# EAGLE design Cheer_vibes (EAGLE 9.4.2)
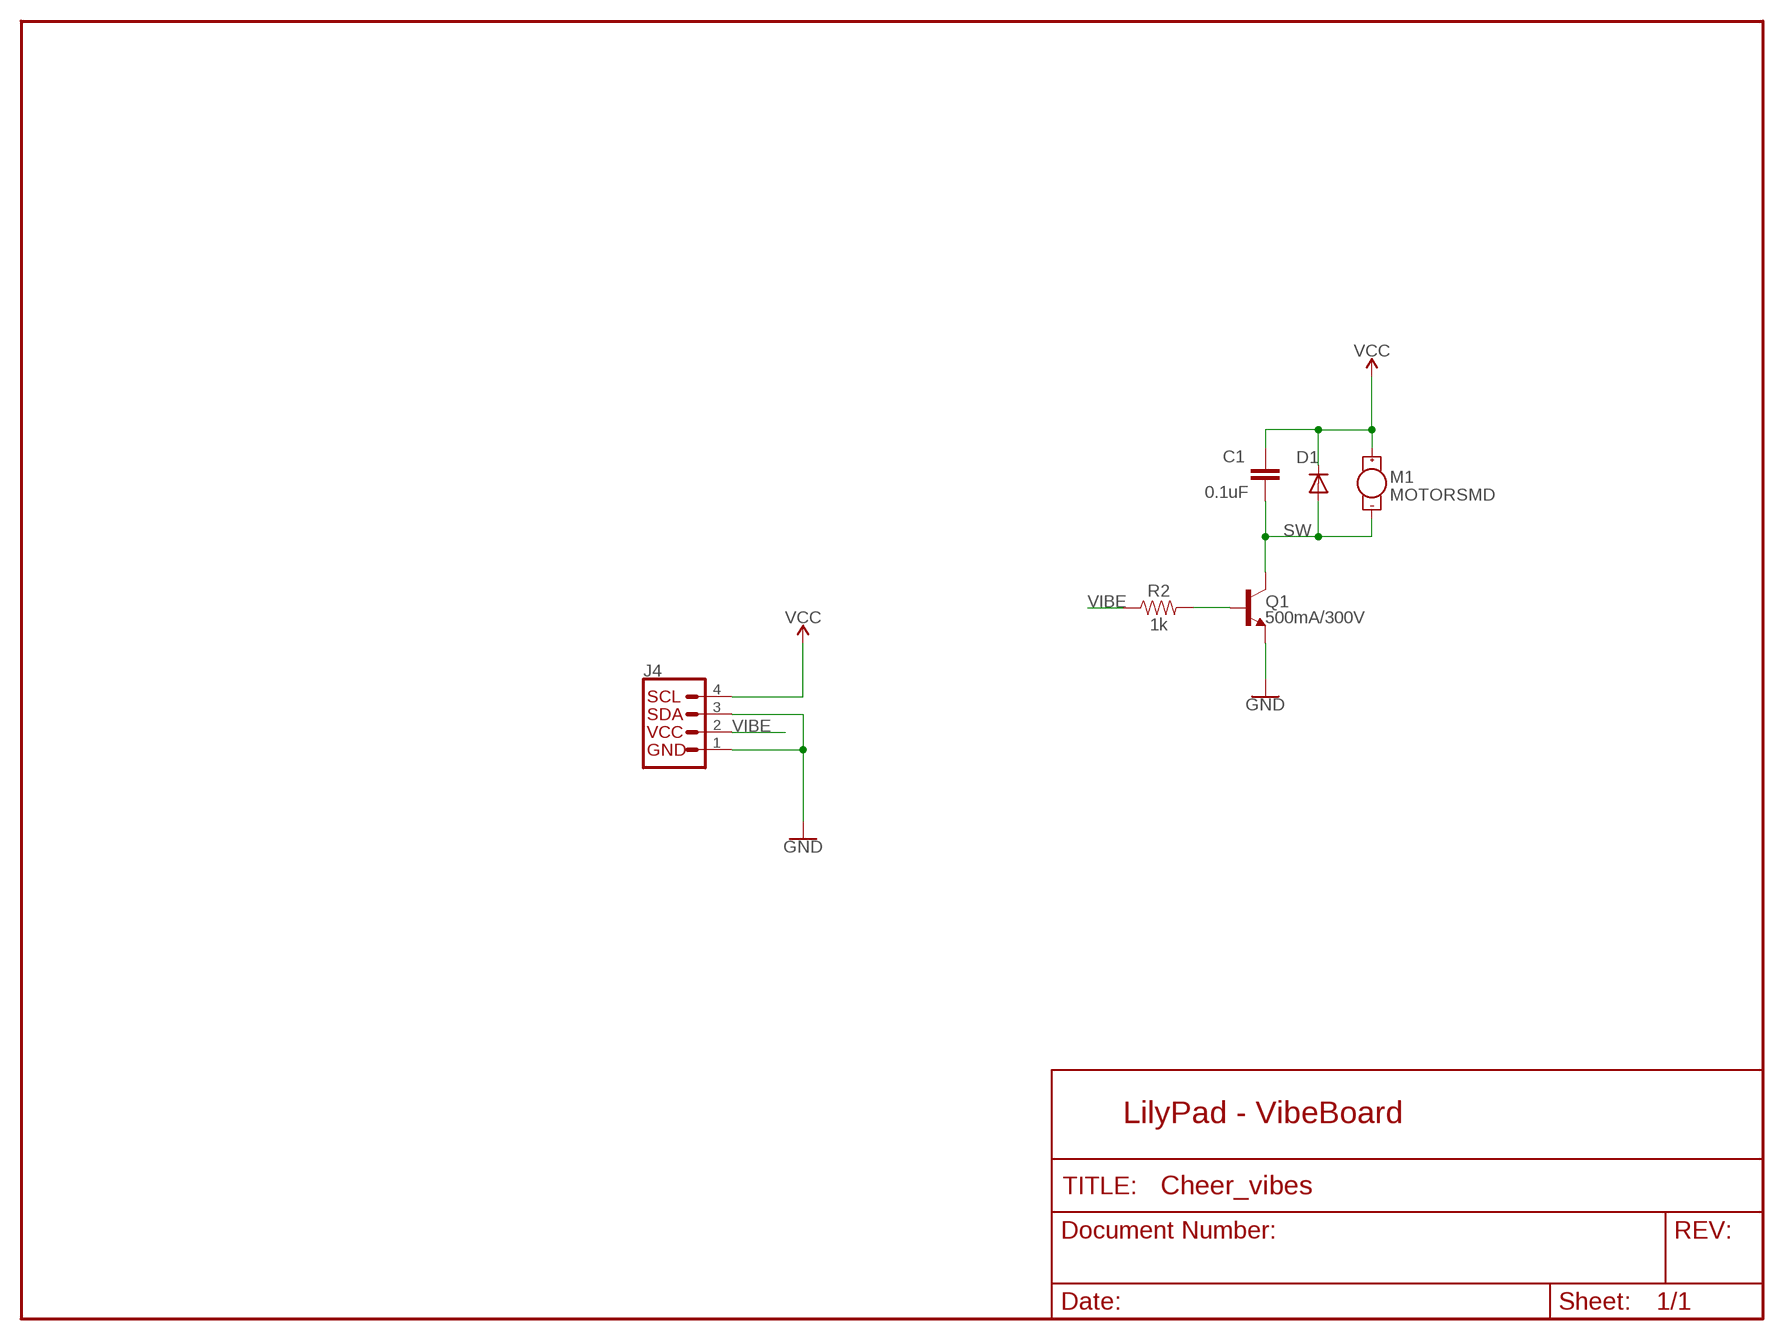
[diagram p0: schematic, sheet 1]

## Parts
C1  0.1uF  0.1UF-0603-25V-(+80/-20%)  [0603]
D1  DIODESOD  [SOD-323]
J4  QWIIC_CONNECTORJS-1MM  [1X04_1MM_RA]
M1  MOTORSMD  [VIBE-MOTOR-10MM-SMD]
Q1  500mA/300V  TRANS_NPN-MMBTA42  [SOT23-3]
R2  1k  1KOHM-0603-1/10W-1%  [0603]

## Nets
GND: J4.1(GND) J4.3(SDA) Q1.2(E)
N$2: Q1.1(B) R2.2
SW: C1.2 D1.2(A) M1.P$2(-) Q1.3(C)
VCC: C1.1 D1.1(C) J4.4(SCL) M1.P$1(+)
VIBE: J4.2(VCC) R2.1

## Notes on the sheet
- LilyPad - VibeBoard

## Library data of the parts
C1 = SparkFun-Capacitors:0.1UF: 0.1µF ceramic capacitors A capacitor is a passive two-terminal electrical component used to store electrical energy temporarily in an electric field.; PROD_ID: CAP-00810
D1 = SparkFun:DIODE: Diode These are standard reverse protection diodes and small signal diodes. SMA package can handle up to about 1A. SOD-323 can handle about 200mA. What the SOD-323 package when ordering, there are some mfgs out there that are 5-pin packages.
J4 = SparkFun-Connectors:QWIIC_CONNECTOR: SparkFun I2C Standard Qwiic Connector An SMD 1mm pitch JST connector makes it easy and quick (get it? Qwiic?) to connect I2C devices to each other. The Qwiic system <http://www.sparkfun.com/qwiic> enables fast and solderless connection between popular platforms and various sensors and actuators. We carry 200mm <https://www.sparkfun.com/products/14204>, 100mm <https://www.sparkfun.com/products/14205>, 50mm <https://www.sparkfun.com/products/14206>, and breadboard friendly <https://www.sparkfun.com/products/14207> Qwiic cables. We also offer 10 pcs strips <https://www.sparkfun.com/products/14323> the SMD connectors.
M1 = Testing:MOTOR: Vibration Motor Physical dimension and wire connections for this powerful vibration motor. Motor has a self adhesive backing. Spark Fun Electronics SKU : ROB-08449
Q1 = SparkFun-DiscreteSemi:TRANS_NPN: NPN transistor Current controlled devices typically used to amplify current or used as a switch. BC547 - COM-08928 <http://www.sparkfun.com/products/8928> (TO-92 45V 100mA) (1.Collector 2.Base 3.Emitter) 2N3904 - COM-00521 <http://www.sparkfun.com/products/521> (TO-92 40V 200mA) (1.Emitter 2.Base 3.Collector) P2N2222A - COM-12852 <http://www.sparkfun.com/products/12852> (TO-92 40V 600mA) (1.Collector 2.Base 3.Emitter); PROD_ID: TRANS-09116
R2 = SparkFun-Resistors:1KOHM: 1kΩ resistor A resistor is a passive two-terminal electrical component that implements electrical resistance as a circuit element. Resistors act to reduce current flow, and, at the same time, act to lower voltage levels within circuits. - Wikipedia; PROD_ID: RES-07856

## Board
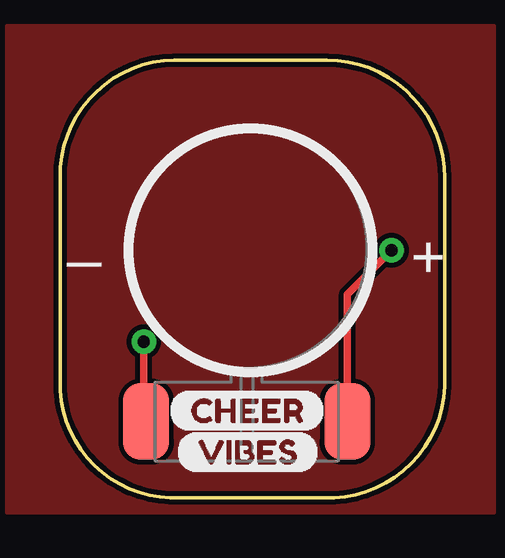
[diagram p1: board, top side]
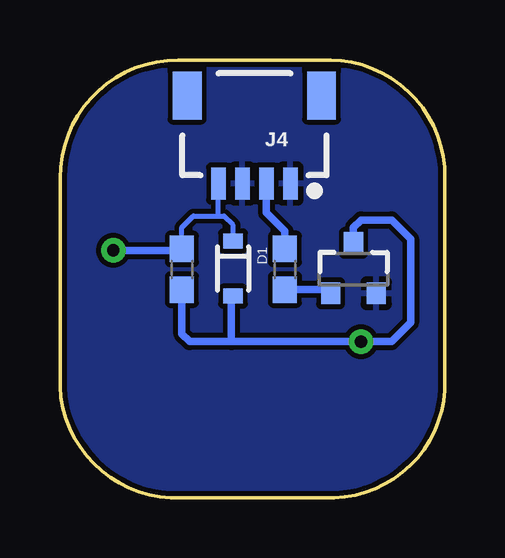
[diagram p2: board, bottom side, seen from below]

Size 16.04 x 18.26 mm. Coordinates in mm from the lower left corner, seen from the top.
Outline: 4.76,18.26 11.11,18.26 arc-90 16.03,13.33 16.03,5.08 arc-90 11.43,0 4.6,0 arc-90 0,4.92 0,13.33 arc-90 4.76,18.26
Copper layers (1*16): Top 0.035mm / dielectric 1.5mm / Bottom 0.035mm
Design rules "SparkFun": minimum track width 8mil, minimum drill 20mil, track to track 8mil, track to pad 8mil, pad to pad 8mil, via to via 8mil, smd to smd 8mil, copper to edge 8mil, drill to drill 8mil, minimum pad ring 12mil, minimum via ring 10mil, stop-mask expansion 4mil, vias tented up to drill 20mil, thermal gap 10mil

### Footprints (pad centres in the part's own frame; a part is rotated, then mirrored left to right if it is on the bottom)
0603 = smd 1.1 x 1: 1 -0.85,0; 2 0.85,0
SOD-323 = smd 0.63 x 0.83: 1 -1.15,0; 2 1.15,0
1X04_1MM_RA = smd 0.6 x 1.35: 1 -1.5,0; 2 -0.5,0; 3 0.5,0; 4 1.5,0 | smd 1.2 x 2: NC1 2.8,-3.675; NC2 -2.8,-3.675
VIBE-MOTOR-10MM-SMD = smd 1.905 x 3.175: P$1 4.191,-7.239; P$2 -4.191,-7.239
SOT23-3 = smd 0.8 x 0.9: 1 -0.95,-1; 2 0.95,-1; 3 0,1.1

### Placement (x,y rotation side)
C1  10.95,9.53 270 bottom
D1  8.83,9.56 270 bottom
J4  7.94,13.1 180 bottom
M1  7.78,10.41 0 top
Q1  3.81,9.53 0 bottom
R2  6.67,9.53 270 bottom
U$1  [CHEER0]  4.53,3.63 0 top
U$2  [VIBES1]  4.84,1.91 0 top

### Tracks (layer width: path | path; a pad name or v marks a point on that pad's centre or on a via)
GND
  pour Top: -2.22,19.68 18.1,19.68 18.1,-0.63 -2.22,-0.63
  pour Bottom: -2.22,19.68 18.1,19.68 18.1,-0.63 -2.22,-0.63
N$2
  Bottom 0.305: Q1.1 4.91,8.68 R2.2
SW  (via drill 0.51)
  Top 0.305: M1.P$2 3.49,3.27 v3.49,6.51
  Bottom 0.305: Q1.3 3.81,11.27 3.49,11.59 2.22,11.59 1.43,10.79 1.43,7.3 2.22,6.51 v3.49,6.51 8.89,6.51 | C1.2 10.95,6.83 10.64,6.51 8.89,6.51 | D1.2 8.89,8.34 8.89,6.51
VCC  (via drill 0.51)
  Top 0.305: M1.P$1 11.97,8.48 v13.81,10.32
  Bottom 0.203: C1.1 10.95,11.27 10.48,11.75 9.44,11.75 | 9.44,11.75 9.21,11.75 8.83,11.37 D1.1 | 9.44,11.75 J4.4
  Bottom 0.305: v13.81,10.32 11.01,10.32 C1.1
VIBE
  Bottom 0.305: J4.2 7.44,11.88 6.67,11.11 R2.1

### Text on the board
tPlace: + | _